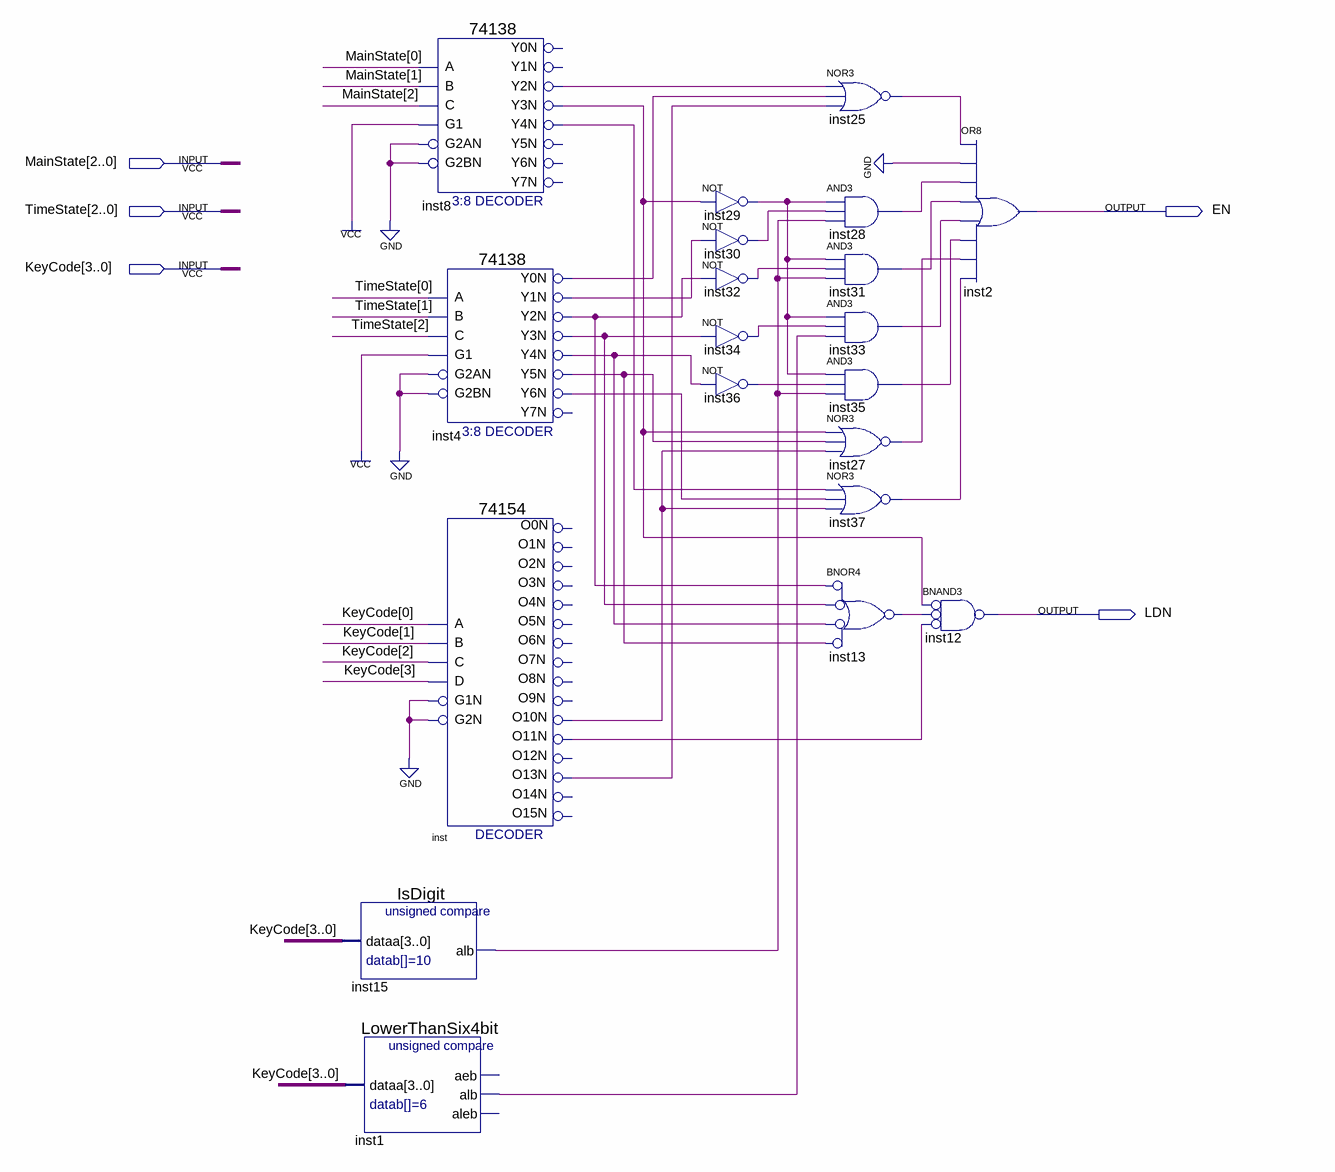
[diagram p0: schematic sheet]
// Quartus schematic TimeStatusControl.bdf as structural Verilog: 20 symbols, 5 pins
module TimeStatusControl (
  input  [2:0] MainState,
  input  [2:0] TimeState,
  input  [3:0] KeyCode,
  output EN,
  output LDN
);

  wire inst1_alb, inst4_y0n, inst4_y1n, inst4_y2n, inst4_y3n, inst4_y4n, inst4_y5n, inst4_y6n, inst8_y2n,
       inst8_y3n, inst8_y4n, inst13_out, inst15_alb, inst25_out, inst27_out, inst28_out, inst29_out,
       inst30_out, inst31_out, inst32_out, inst33_out, inst34_out, inst35_out, inst36_out, inst37_out,
       inst_o10n, inst_o11n, inst_o13n;

  IsDigit inst15 (.dataa(KeyCode), .alb(inst15_alb));
  LowerThanSix4bit inst1 (.dataa(KeyCode), .alb(inst1_alb));  // open: aeb, aleb
  \74138  inst8 (
    .A(MainState[0]), .B(MainState[1]), .G1(1'b1), .C(MainState[2]), .G2AN(1'b0), .G2BN(1'b0),
    .Y2N(inst8_y2n), .Y3N(inst8_y3n), .Y4N(inst8_y4n));  // open: Y0N, Y1N, Y5N, Y6N, Y7N
  \74138  inst4 (
    .A(TimeState[0]), .B(TimeState[1]), .G1(1'b1), .C(TimeState[2]), .G2AN(1'b0), .G2BN(1'b0),
    .Y0N(inst4_y0n), .Y1N(inst4_y1n), .Y2N(inst4_y2n), .Y3N(inst4_y3n), .Y4N(inst4_y4n), .Y5N(inst4_y5n),
    .Y6N(inst4_y6n));  // open: Y7N
  \74154  inst (
    .C(KeyCode[2]), .D(KeyCode[3]), .B(KeyCode[1]), .A(KeyCode[0]), .G1N(1'b0), .G2N(1'b0), .O10N(inst_o10n),
    .O11N(inst_o11n), .O13N(inst_o13n));  // open: O0N, O12N, O15N, O1N, O14N, O4N, O3N, O2N, O7N, O6N, O5N, O9N, O8N
  not inst29 (inst29_out, inst8_y3n);
  not inst30 (inst30_out, inst4_y1n);
  not inst32 (inst32_out, inst4_y2n);
  not inst34 (inst34_out, inst4_y3n);
  not inst36 (inst36_out, inst4_y4n);
  nor inst25 (inst25_out, inst8_y2n, inst4_y0n, inst_o13n);
  and inst28 (inst28_out, inst29_out, inst30_out, inst15_alb);
  and inst31 (inst31_out, inst29_out, inst32_out, inst15_alb);
  and inst33 (inst33_out, inst29_out, inst34_out, inst1_alb);
  and inst35 (inst35_out, inst29_out, inst36_out, inst15_alb);
  nor inst27 (inst27_out, inst8_y3n, inst4_y5n, inst_o10n);
  nor inst37 (inst37_out, inst8_y4n, inst4_y6n, inst_o10n);
  nor inst13 (inst13_out, ~inst4_y2n, ~inst4_y3n, ~inst4_y4n, ~inst4_y5n);  // BNOR4
  nand inst12 (LDN, ~inst8_y3n, ~inst13_out, ~inst_o11n);  // BNAND3
  or inst2 (EN, inst25_out, 1'b0, inst28_out, inst31_out, inst33_out, inst35_out, inst27_out, inst37_out);
endmodule
